# Altium schematic sheet LED_DISPLAY_SCHE.SchDoc
size C; SheetNumber: 3; SheetTotal: 3
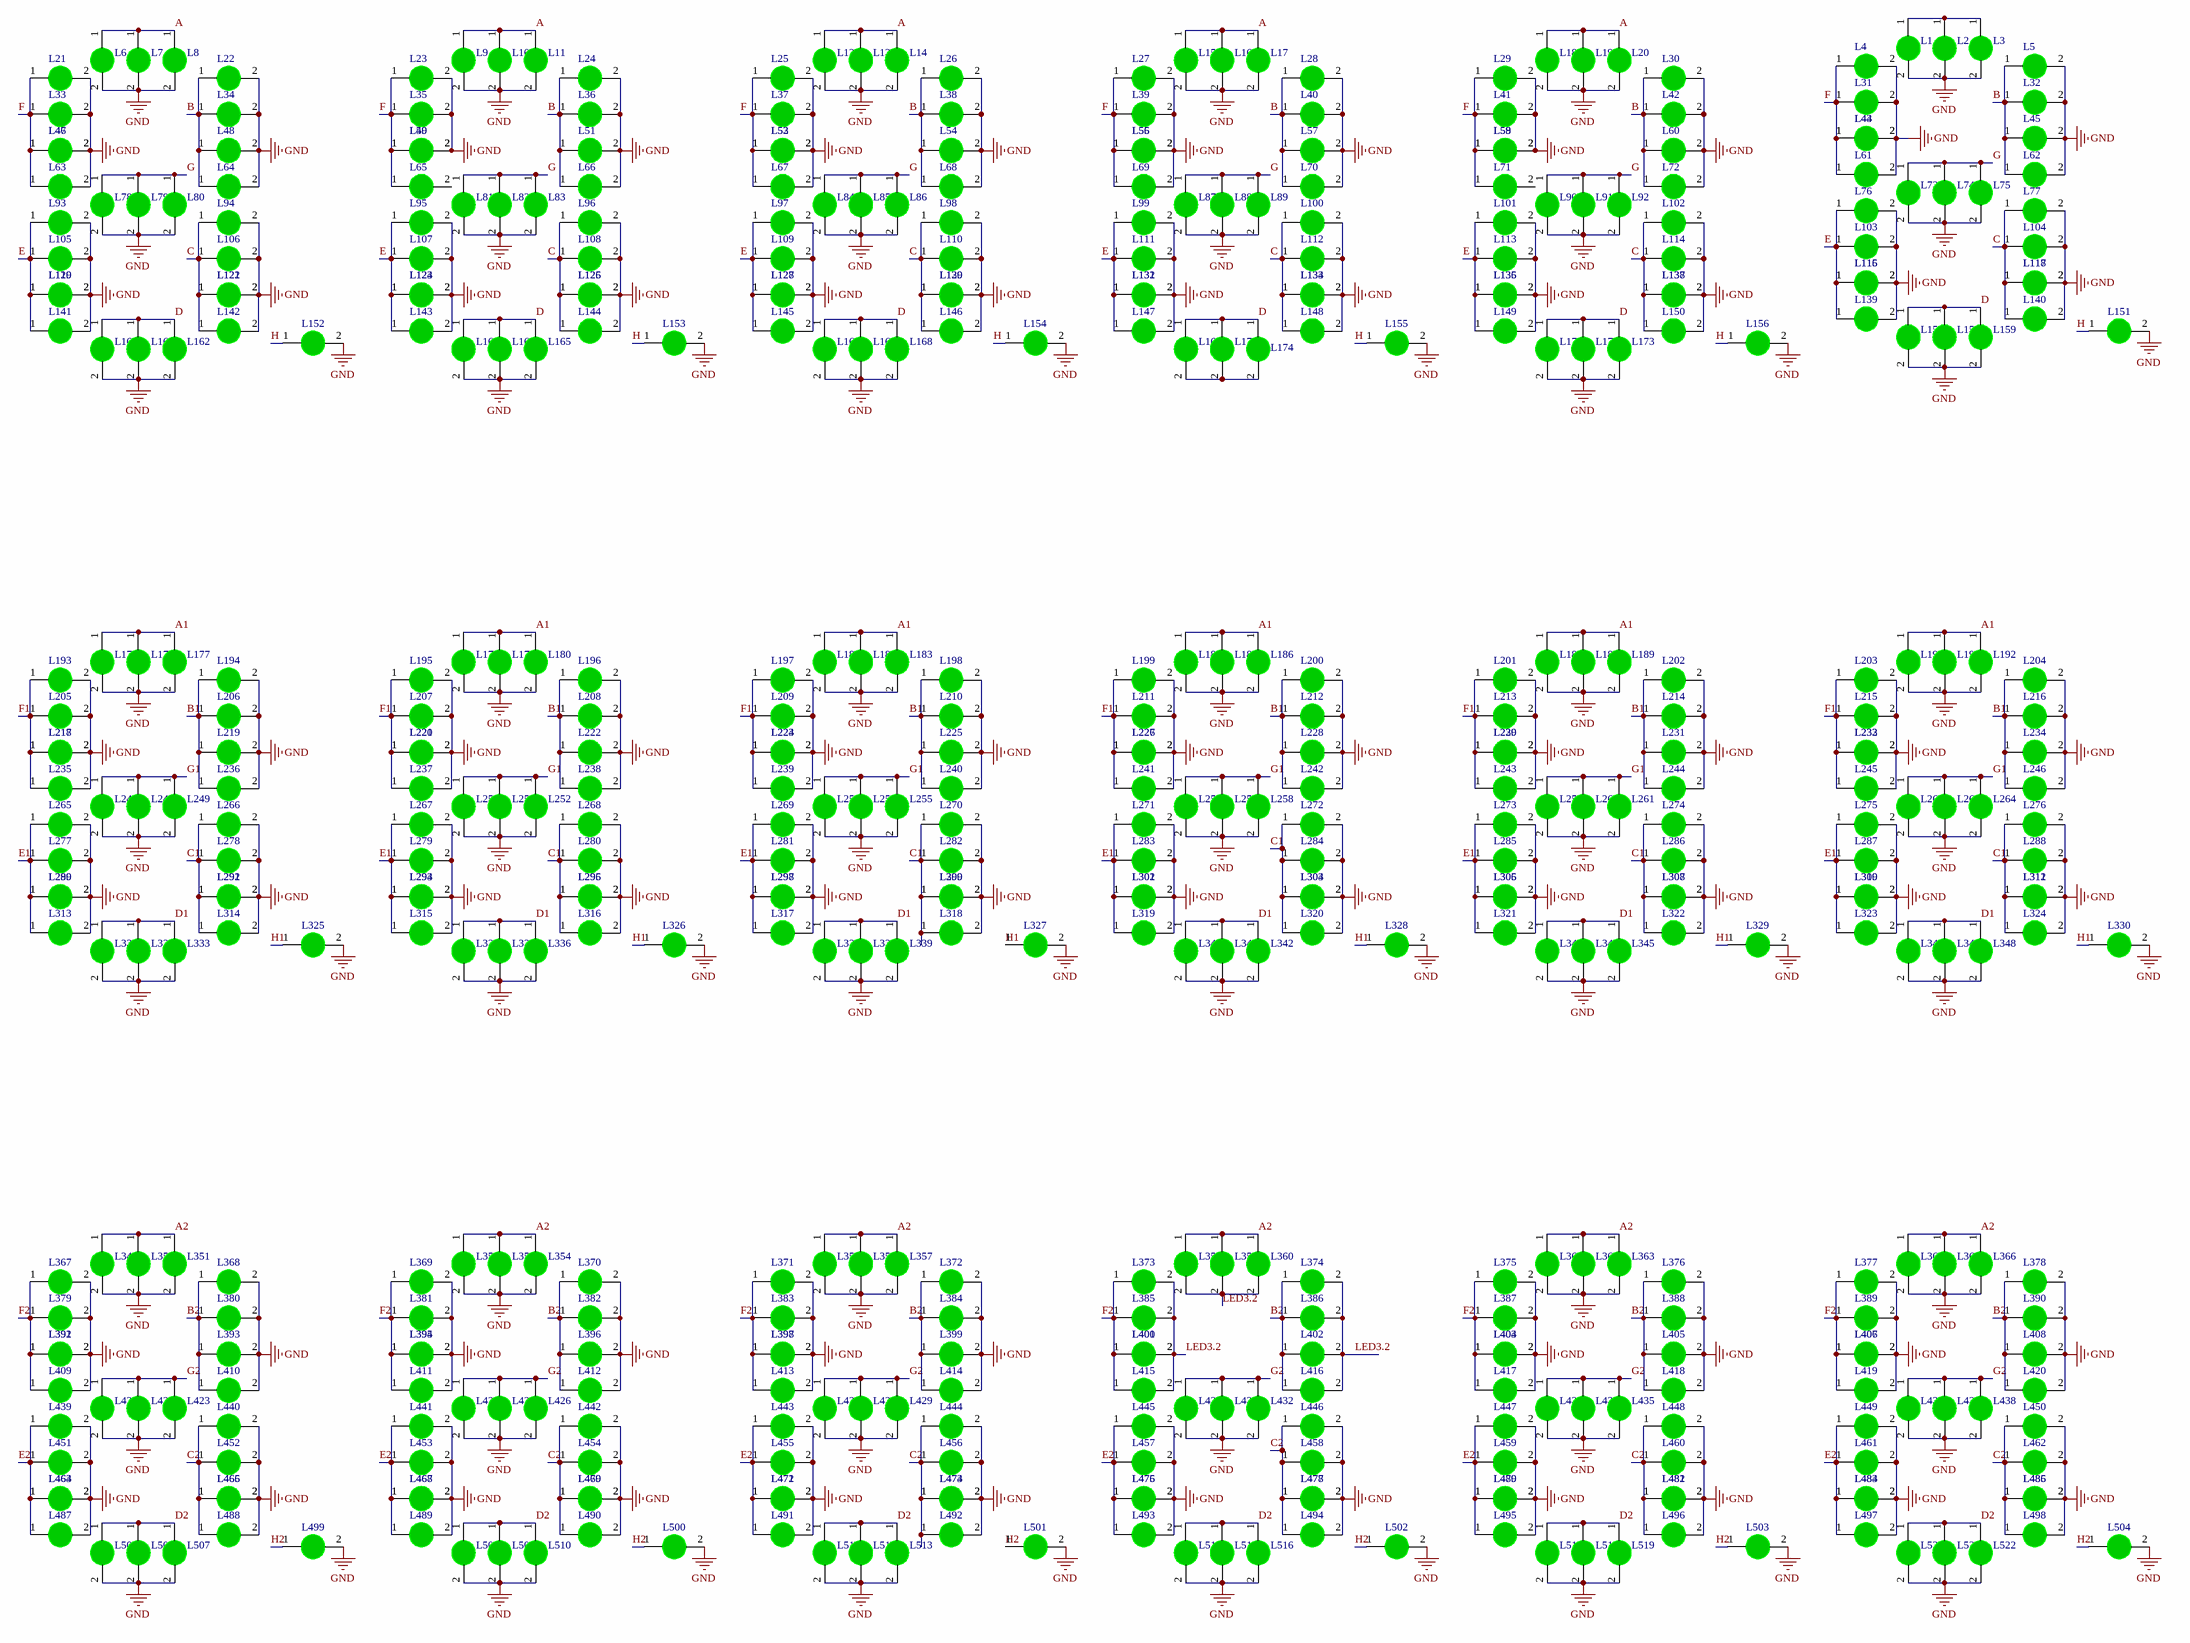
[diagram p0: LED_DISPLAY_SCHE.SchDoc]

## Parts
L1  LED 3528  [LED-3528-GREEN]  (value not drawn)
L2  LED 3528  [LED-3528-GREEN]  (value not drawn)
L3  LED 3528  [LED-3528-GREEN]  (value not drawn)
L4  LED 3528  [LED-3528-GREEN]  (value not drawn)
L5  LED 3528  [LED-3528-GREEN]  (value not drawn)
L6  LED 3528  [LED-3528-GREEN]  (value not drawn)
L7  LED 3528  [LED-3528-GREEN]  (value not drawn)
L8  LED 3528  [LED-3528-GREEN]  (value not drawn)
L9  LED 3528  [LED-3528-GREEN]  (value not drawn)
L10  LED 3528  [LED-3528-GREEN]  (value not drawn)
L11  LED 3528  [LED-3528-GREEN]  (value not drawn)
L12  LED 3528  [LED-3528-GREEN]  (value not drawn)
L13  LED 3528  [LED-3528-GREEN]  (value not drawn)
L14  LED 3528  [LED-3528-GREEN]  (value not drawn)
L15  LED 3528  [LED-3528-GREEN]  (value not drawn)
L16  LED 3528  [LED-3528-GREEN]  (value not drawn)
L17  LED 3528  [LED-3528-GREEN]  (value not drawn)
L18  LED 3528  [LED-3528-GREEN]  (value not drawn)
L19  LED 3528  [LED-3528-GREEN]  (value not drawn)
L20  LED 3528  [LED-3528-GREEN]  (value not drawn)
L21  LED 3528  [LED-3528-GREEN]  (value not drawn)
L22  LED 3528  [LED-3528-GREEN]  (value not drawn)
L23  LED 3528  [LED-3528-GREEN]  (value not drawn)
L24  LED 3528  [LED-3528-GREEN]  (value not drawn)
L25  LED 3528  [LED-3528-GREEN]  (value not drawn)
L26  LED 3528  [LED-3528-GREEN]  (value not drawn)
L27  LED 3528  [LED-3528-GREEN]  (value not drawn)
L28  LED 3528  [LED-3528-GREEN]  (value not drawn)
L29  LED 3528  [LED-3528-GREEN]  (value not drawn)
L30  LED 3528  [LED-3528-GREEN]  (value not drawn)
L31  LED 3528  [LED-3528-GREEN]  (value not drawn)
L32  LED 3528  [LED-3528-GREEN]  (value not drawn)
L33  LED 3528  [LED-3528-GREEN]  (value not drawn)
L34  LED 3528  [LED-3528-GREEN]  (value not drawn)
L35  LED 3528  [LED-3528-GREEN]  (value not drawn)
L36  LED 3528  [LED-3528-GREEN]  (value not drawn)
L37  LED 3528  [LED-3528-GREEN]  (value not drawn)
L38  LED 3528  [LED-3528-GREEN]  (value not drawn)
L39  LED 3528  [LED-3528-GREEN]  (value not drawn)
L40  LED 3528  [LED-3528-GREEN]  (value not drawn)
L41  LED 3528  [LED-3528-GREEN]  (value not drawn)
L42  LED 3528  [LED-3528-GREEN]  (value not drawn)
L43  LED 3528  [LED-3528-GREEN]  (value not drawn)
L44  LED 3528  [LED-3528-GREEN]  (value not drawn)
L45  LED 3528  [LED-3528-GREEN]  (value not drawn)
L46  LED 3528  [LED-3528-GREEN]  (value not drawn)
L47  LED 3528  [LED-3528-GREEN]  (value not drawn)
L48  LED 3528  [LED-3528-GREEN]  (value not drawn)
L49  LED 3528  [LED-3528-GREEN]  (value not drawn)
L50  LED 3528  [LED-3528-GREEN]  (value not drawn)
L51  LED 3528  [LED-3528-GREEN]  (value not drawn)
L52  LED 3528  [LED-3528-GREEN]  (value not drawn)
L53  LED 3528  [LED-3528-GREEN]  (value not drawn)
L54  LED 3528  [LED-3528-GREEN]  (value not drawn)
L55  LED 3528  [LED-3528-GREEN]  (value not drawn)
L56  LED 3528  [LED-3528-GREEN]  (value not drawn)
L57  LED 3528  [LED-3528-GREEN]  (value not drawn)
L58  LED 3528  [LED-3528-GREEN]  (value not drawn)
L59  LED 3528  [LED-3528-GREEN]  (value not drawn)
L60  LED 3528  [LED-3528-GREEN]  (value not drawn)
L61  LED 3528  [LED-3528-GREEN]  (value not drawn)
L62  LED 3528  [LED-3528-GREEN]  (value not drawn)
L63  LED 3528  [LED-3528-GREEN]  (value not drawn)
L64  LED 3528  [LED-3528-GREEN]  (value not drawn)
L65  LED 3528  [LED-3528-GREEN]  (value not drawn)
L66  LED 3528  [LED-3528-GREEN]  (value not drawn)
L67  LED 3528  [LED-3528-GREEN]  (value not drawn)
L68  LED 3528  [LED-3528-GREEN]  (value not drawn)
L69  LED 3528  [LED-3528-GREEN]  (value not drawn)
L70  LED 3528  [LED-3528-GREEN]  (value not drawn)
L71  LED 3528  [LED-3528-GREEN]  (value not drawn)
L72  LED 3528  [LED-3528-GREEN]  (value not drawn)
L73  LED 3528  [LED-3528-GREEN]  (value not drawn)
L74  LED 3528  [LED-3528-GREEN]  (value not drawn)
L75  LED 3528  [LED-3528-GREEN]  (value not drawn)
L76  LED 3528  [LED-3528-GREEN]  (value not drawn)
L77  LED 3528  [LED-3528-GREEN]  (value not drawn)
L78  LED 3528  [LED-3528-GREEN]  (value not drawn)
L79  LED 3528  [LED-3528-GREEN]  (value not drawn)
L80  LED 3528  [LED-3528-GREEN]  (value not drawn)
L81  LED 3528  [LED-3528-GREEN]  (value not drawn)
L82  LED 3528  [LED-3528-GREEN]  (value not drawn)
L83  LED 3528  [LED-3528-GREEN]  (value not drawn)
L84  LED 3528  [LED-3528-GREEN]  (value not drawn)
L85  LED 3528  [LED-3528-GREEN]  (value not drawn)
L86  LED 3528  [LED-3528-GREEN]  (value not drawn)
L87  LED 3528  [LED-3528-GREEN]  (value not drawn)
L88  LED 3528  [LED-3528-GREEN]  (value not drawn)
L89  LED 3528  [LED-3528-GREEN]  (value not drawn)
L90  LED 3528  [LED-3528-GREEN]  (value not drawn)
L91  LED 3528  [LED-3528-GREEN]  (value not drawn)
L92  LED 3528  [LED-3528-GREEN]  (value not drawn)
L93  LED 3528  [LED-3528-GREEN]  (value not drawn)
L94  LED 3528  [LED-3528-GREEN]  (value not drawn)
L95  LED 3528  [LED-3528-GREEN]  (value not drawn)
L96  LED 3528  [LED-3528-GREEN]  (value not drawn)
L97  LED 3528  [LED-3528-GREEN]  (value not drawn)
L98  LED 3528  [LED-3528-GREEN]  (value not drawn)
L99  LED 3528  [LED-3528-GREEN]  (value not drawn)
L100  LED 3528  [LED-3528-GREEN]  (value not drawn)
L101  LED 3528  [LED-3528-GREEN]  (value not drawn)
L102  LED 3528  [LED-3528-GREEN]  (value not drawn)
L103  LED 3528  [LED-3528-GREEN]  (value not drawn)
L104  LED 3528  [LED-3528-GREEN]  (value not drawn)
L105  LED 3528  [LED-3528-GREEN]  (value not drawn)
L106  LED 3528  [LED-3528-GREEN]  (value not drawn)
L107  LED 3528  [LED-3528-GREEN]  (value not drawn)
L108  LED 3528  [LED-3528-GREEN]  (value not drawn)
L109  LED 3528  [LED-3528-GREEN]  (value not drawn)
L110  LED 3528  [LED-3528-GREEN]  (value not drawn)
L111  LED 3528  [LED-3528-GREEN]  (value not drawn)
L112  LED 3528  [LED-3528-GREEN]  (value not drawn)
L113  LED 3528  [LED-3528-GREEN]  (value not drawn)
L114  LED 3528  [LED-3528-GREEN]  (value not drawn)
L115  LED 3528  [LED-3528-GREEN]  (value not drawn)
L116  LED 3528  [LED-3528-GREEN]  (value not drawn)
L117  LED 3528  [LED-3528-GREEN]  (value not drawn)
L118  LED 3528  [LED-3528-GREEN]  (value not drawn)
L119  LED 3528  [LED-3528-GREEN]  (value not drawn)
L120  LED 3528  [LED-3528-GREEN]  (value not drawn)
L121  LED 3528  [LED-3528-GREEN]  (value not drawn)
L122  LED 3528  [LED-3528-GREEN]  (value not drawn)
L123  LED 3528  [LED-3528-GREEN]  (value not drawn)
L124  LED 3528  [LED-3528-GREEN]  (value not drawn)
L125  LED 3528  [LED-3528-GREEN]  (value not drawn)
L126  LED 3528  [LED-3528-GREEN]  (value not drawn)
L127  LED 3528  [LED-3528-GREEN]  (value not drawn)
L128  LED 3528  [LED-3528-GREEN]  (value not drawn)
L129  LED 3528  [LED-3528-GREEN]  (value not drawn)
L130  LED 3528  [LED-3528-GREEN]  (value not drawn)
L131  LED 3528  [LED-3528-GREEN]  (value not drawn)
L132  LED 3528  [LED-3528-GREEN]  (value not drawn)
L133  LED 3528  [LED-3528-GREEN]  (value not drawn)
L134  LED 3528  [LED-3528-GREEN]  (value not drawn)
L135  LED 3528  [LED-3528-GREEN]  (value not drawn)
L136  LED 3528  [LED-3528-GREEN]  (value not drawn)
L137  LED 3528  [LED-3528-GREEN]  (value not drawn)
L138  LED 3528  [LED-3528-GREEN]  (value not drawn)
L139  LED 3528  [LED-3528-GREEN]  (value not drawn)
L140  LED 3528  [LED-3528-GREEN]  (value not drawn)
L141  LED 3528  [LED-3528-GREEN]  (value not drawn)
L142  LED 3528  [LED-3528-GREEN]  (value not drawn)
L143  LED 3528  [LED-3528-GREEN]  (value not drawn)
L144  LED 3528  [LED-3528-GREEN]  (value not drawn)
L145  LED 3528  [LED-3528-GREEN]  (value not drawn)
L146  LED 3528  [LED-3528-GREEN]  (value not drawn)
L147  LED 3528  [LED-3528-GREEN]  (value not drawn)
L148  LED 3528  [LED-3528-GREEN]  (value not drawn)
L149  LED 3528  [LED-3528-GREEN]  (value not drawn)
L150  LED 3528  [LED-3528-GREEN]  (value not drawn)
L151  LED 3528  [LED-3528-GREEN]  (value not drawn)
L152  LED 3528  [LED-3528-GREEN]  (value not drawn)
L153  LED 3528  [LED-3528-GREEN]  (value not drawn)
L154  LED 3528  [LED-3528-GREEN]  (value not drawn)
L155  LED 3528  [LED-3528-GREEN]  (value not drawn)
L156  LED 3528  [LED-3528-GREEN]  (value not drawn)
L157  LED 3528  [LED-3528-GREEN]  (value not drawn)
L158  LED 3528  [LED-3528-GREEN]  (value not drawn)
L159  LED 3528  [LED-3528-GREEN]  (value not drawn)
L160  LED 3528  [LED-3528-GREEN]  (value not drawn)
L161  LED 3528  [LED-3528-GREEN]  (value not drawn)
L162  LED 3528  [LED-3528-GREEN]  (value not drawn)
L163  LED 3528  [LED-3528-GREEN]  (value not drawn)
L164  LED 3528  [LED-3528-GREEN]  (value not drawn)
L165  LED 3528  [LED-3528-GREEN]  (value not drawn)
L166  LED 3528  [LED-3528-GREEN]  (value not drawn)
L167  LED 3528  [LED-3528-GREEN]  (value not drawn)
L168  LED 3528  [LED-3528-GREEN]  (value not drawn)
L169  LED 3528  [LED-3528-GREEN]  (value not drawn)
L170  LED 3528  [LED-3528-GREEN]  (value not drawn)
L171  LED 3528  [LED-3528-GREEN]  (value not drawn)
L172  LED 3528  [LED-3528-GREEN]  (value not drawn)
L173  LED 3528  [LED-3528-GREEN]  (value not drawn)
L174  LED 3528  [LED-3528-GREEN]  (value not drawn)
L175  LED 3528  [LED-3528-GREEN]  (value not drawn)
L176  LED 3528  [LED-3528-GREEN]  (value not drawn)
L177  LED 3528  [LED-3528-GREEN]  (value not drawn)
L178  LED 3528  [LED-3528-GREEN]  (value not drawn)
L179  LED 3528  [LED-3528-GREEN]  (value not drawn)
L180  LED 3528  [LED-3528-GREEN]  (value not drawn)
L181  LED 3528  [LED-3528-GREEN]  (value not drawn)
L182  LED 3528  [LED-3528-GREEN]  (value not drawn)
L183  LED 3528  [LED-3528-GREEN]  (value not drawn)
L184  LED 3528  [LED-3528-GREEN]  (value not drawn)
L185  LED 3528  [LED-3528-GREEN]  (value not drawn)
L186  LED 3528  [LED-3528-GREEN]  (value not drawn)
L187  LED 3528  [LED-3528-GREEN]  (value not drawn)
L188  LED 3528  [LED-3528-GREEN]  (value not drawn)
L189  LED 3528  [LED-3528-GREEN]  (value not drawn)
L190  LED 3528  [LED-3528-GREEN]  (value not drawn)
L191  LED 3528  [LED-3528-GREEN]  (value not drawn)
L192  LED 3528  [LED-3528-GREEN]  (value not drawn)
L193  LED 3528  [LED-3528-GREEN]  (value not drawn)
L194  LED 3528  [LED-3528-GREEN]  (value not drawn)
L195  LED 3528  [LED-3528-GREEN]  (value not drawn)
L196  LED 3528  [LED-3528-GREEN]  (value not drawn)
L197  LED 3528  [LED-3528-GREEN]  (value not drawn)
L198  LED 3528  [LED-3528-GREEN]  (value not drawn)
L199  LED 3528  [LED-3528-GREEN]  (value not drawn)
L200  LED 3528  [LED-3528-GREEN]  (value not drawn)
L201  LED 3528  [LED-3528-GREEN]  (value not drawn)
L202  LED 3528  [LED-3528-GREEN]  (value not drawn)
L203  LED 3528  [LED-3528-GREEN]  (value not drawn)
L204  LED 3528  [LED-3528-GREEN]  (value not drawn)
L205  LED 3528  [LED-3528-GREEN]  (value not drawn)
L206  LED 3528  [LED-3528-GREEN]  (value not drawn)
L207  LED 3528  [LED-3528-GREEN]  (value not drawn)
L208  LED 3528  [LED-3528-GREEN]  (value not drawn)
L209  LED 3528  [LED-3528-GREEN]  (value not drawn)
L210  LED 3528  [LED-3528-GREEN]  (value not drawn)
L211  LED 3528  [LED-3528-GREEN]  (value not drawn)
L212  LED 3528  [LED-3528-GREEN]  (value not drawn)
L213  LED 3528  [LED-3528-GREEN]  (value not drawn)
L214  LED 3528  [LED-3528-GREEN]  (value not drawn)
L215  LED 3528  [LED-3528-GREEN]  (value not drawn)
L216  LED 3528  [LED-3528-GREEN]  (value not drawn)
L217  LED 3528  [LED-3528-GREEN]  (value not drawn)
L218  LED 3528  [LED-3528-GREEN]  (value not drawn)
L219  LED 3528  [LED-3528-GREEN]  (value not drawn)
L220  LED 3528  [LED-3528-GREEN]  (value not drawn)
L221  LED 3528  [LED-3528-GREEN]  (value not drawn)
L222  LED 3528  [LED-3528-GREEN]  (value not drawn)
L223  LED 3528  [LED-3528-GREEN]  (value not drawn)
L224  LED 3528  [LED-3528-GREEN]  (value not drawn)
L225  LED 3528  [LED-3528-GREEN]  (value not drawn)
L226  LED 3528  [LED-3528-GREEN]  (value not drawn)
L227  LED 3528  [LED-3528-GREEN]  (value not drawn)
L228  LED 3528  [LED-3528-GREEN]  (value not drawn)
L229  LED 3528  [LED-3528-GREEN]  (value not drawn)
L230  LED 3528  [LED-3528-GREEN]  (value not drawn)
L231  LED 3528  [LED-3528-GREEN]  (value not drawn)
L232  LED 3528  [LED-3528-GREEN]  (value not drawn)
L233  LED 3528  [LED-3528-GREEN]  (value not drawn)
L234  LED 3528  [LED-3528-GREEN]  (value not drawn)
L235  LED 3528  [LED-3528-GREEN]  (value not drawn)
L236  LED 3528  [LED-3528-GREEN]  (value not drawn)
L237  LED 3528  [LED-3528-GREEN]  (value not drawn)
L238  LED 3528  [LED-3528-GREEN]  (value not drawn)
L239  LED 3528  [LED-3528-GREEN]  (value not drawn)
L240  LED 3528  [LED-3528-GREEN]  (value not drawn)
L241  LED 3528  [LED-3528-GREEN]  (value not drawn)
L242  LED 3528  [LED-3528-GREEN]  (value not drawn)
L243  LED 3528  [LED-3528-GREEN]  (value not drawn)
L244  LED 3528  [LED-3528-GREEN]  (value not drawn)
L245  LED 3528  [LED-3528-GREEN]  (value not drawn)
L246  LED 3528  [LED-3528-GREEN]  (value not drawn)
L247  LED 3528  [LED-3528-GREEN]  (value not drawn)
L248  LED 3528  [LED-3528-GREEN]  (value not drawn)
L249  LED 3528  [LED-3528-GREEN]  (value not drawn)
L250  LED 3528  [LED-3528-GREEN]  (value not drawn)
L251  LED 3528  [LED-3528-GREEN]  (value not drawn)
L252  LED 3528  [LED-3528-GREEN]  (value not drawn)
L253  LED 3528  [LED-3528-GREEN]  (value not drawn)
L254  LED 3528  [LED-3528-GREEN]  (value not drawn)
L255  LED 3528  [LED-3528-GREEN]  (value not drawn)
L256  LED 3528  [LED-3528-GREEN]  (value not drawn)
L257  LED 3528  [LED-3528-GREEN]  (value not drawn)
L258  LED 3528  [LED-3528-GREEN]  (value not drawn)
L259  LED 3528  [LED-3528-GREEN]  (value not drawn)
L260  LED 3528  [LED-3528-GREEN]  (value not drawn)
L261  LED 3528  [LED-3528-GREEN]  (value not drawn)
L262  LED 3528  [LED-3528-GREEN]  (value not drawn)
L263  LED 3528  [LED-3528-GREEN]  (value not drawn)
L264  LED 3528  [LED-3528-GREEN]  (value not drawn)
L265  LED 3528  [LED-3528-GREEN]  (value not drawn)
L266  LED 3528  [LED-3528-GREEN]  (value not drawn)
L267  LED 3528  [LED-3528-GREEN]  (value not drawn)
L268  LED 3528  [LED-3528-GREEN]  (value not drawn)
L269  LED 3528  [LED-3528-GREEN]  (value not drawn)
L270  LED 3528  [LED-3528-GREEN]  (value not drawn)
L271  LED 3528  [LED-3528-GREEN]  (value not drawn)
L272  LED 3528  [LED-3528-GREEN]  (value not drawn)
L273  LED 3528  [LED-3528-GREEN]  (value not drawn)
L274  LED 3528  [LED-3528-GREEN]  (value not drawn)
L275  LED 3528  [LED-3528-GREEN]  (value not drawn)
L276  LED 3528  [LED-3528-GREEN]  (value not drawn)
L277  LED 3528  [LED-3528-GREEN]  (value not drawn)
L278  LED 3528  [LED-3528-GREEN]  (value not drawn)
L279  LED 3528  [LED-3528-GREEN]  (value not drawn)
L280  LED 3528  [LED-3528-GREEN]  (value not drawn)
L281  LED 3528  [LED-3528-GREEN]  (value not drawn)
L282  LED 3528  [LED-3528-GREEN]  (value not drawn)
L283  LED 3528  [LED-3528-GREEN]  (value not drawn)
L284  LED 3528  [LED-3528-GREEN]  (value not drawn)
L285  LED 3528  [LED-3528-GREEN]  (value not drawn)
L286  LED 3528  [LED-3528-GREEN]  (value not drawn)
L287  LED 3528  [LED-3528-GREEN]  (value not drawn)
L288  LED 3528  [LED-3528-GREEN]  (value not drawn)
L289  LED 3528  [LED-3528-GREEN]  (value not drawn)
L290  LED 3528  [LED-3528-GREEN]  (value not drawn)
L291  LED 3528  [LED-3528-GREEN]  (value not drawn)
L292  LED 3528  [LED-3528-GREEN]  (value not drawn)
L293  LED 3528  [LED-3528-GREEN]  (value not drawn)
L294  LED 3528  [LED-3528-GREEN]  (value not drawn)
L295  LED 3528  [LED-3528-GREEN]  (value not drawn)
L296  LED 3528  [LED-3528-GREEN]  (value not drawn)
L297  LED 3528  [LED-3528-GREEN]  (value not drawn)
L298  LED 3528  [LED-3528-GREEN]  (value not drawn)
L299  LED 3528  [LED-3528-GREEN]  (value not drawn)
L300  LED 3528  [LED-3528-GREEN]  (value not drawn)
L301  LED 3528  [LED-3528-GREEN]  (value not drawn)
L302  LED 3528  [LED-3528-GREEN]  (value not drawn)
L303  LED 3528  [LED-3528-GREEN]  (value not drawn)
L304  LED 3528  [LED-3528-GREEN]  (value not drawn)
L305  LED 3528  [LED-3528-GREEN]  (value not drawn)
L306  LED 3528  [LED-3528-GREEN]  (value not drawn)
L307  LED 3528  [LED-3528-GREEN]  (value not drawn)
L308  LED 3528  [LED-3528-GREEN]  (value not drawn)
L309  LED 3528  [LED-3528-GREEN]  (value not drawn)
L310  LED 3528  [LED-3528-GREEN]  (value not drawn)
L311  LED 3528  [LED-3528-GREEN]  (value not drawn)
L312  LED 3528  [LED-3528-GREEN]  (value not drawn)
L313  LED 3528  [LED-3528-GREEN]  (value not drawn)
L314  LED 3528  [LED-3528-GREEN]  (value not drawn)
L315  LED 3528  [LED-3528-GREEN]  (value not drawn)
L316  LED 3528  [LED-3528-GREEN]  (value not drawn)
L317  LED 3528  [LED-3528-GREEN]  (value not drawn)
L318  LED 3528  [LED-3528-GREEN]  (value not drawn)
L319  LED 3528  [LED-3528-GREEN]  (value not drawn)
L320  LED 3528  [LED-3528-GREEN]  (value not drawn)
L321  LED 3528  [LED-3528-GREEN]  (value not drawn)
L322  LED 3528  [LED-3528-GREEN]  (value not drawn)
L323  LED 3528  [LED-3528-GREEN]  (value not drawn)
L324  LED 3528  [LED-3528-GREEN]  (value not drawn)
L325  LED 3528  [LED-3528-GREEN]  (value not drawn)
L326  LED 3528  [LED-3528-GREEN]  (value not drawn)
L327  LED 3528  [LED-3528-GREEN]  (value not drawn)
L328  LED 3528  [LED-3528-GREEN]  (value not drawn)
L329  LED 3528  [LED-3528-GREEN]  (value not drawn)
L330  LED 3528  [LED-3528-GREEN]  (value not drawn)
L331  LED 3528  [LED-3528-GREEN]  (value not drawn)
L332  LED 3528  [LED-3528-GREEN]  (value not drawn)
L333  LED 3528  [LED-3528-GREEN]  (value not drawn)
L334  LED 3528  [LED-3528-GREEN]  (value not drawn)
L335  LED 3528  [LED-3528-GREEN]  (value not drawn)
L336  LED 3528  [LED-3528-GREEN]  (value not drawn)
L337  LED 3528  [LED-3528-GREEN]  (value not drawn)
L338  LED 3528  [LED-3528-GREEN]  (value not drawn)
L339  LED 3528  [LED-3528-GREEN]  (value not drawn)
L340  LED 3528  [LED-3528-GREEN]  (value not drawn)
L341  LED 3528  [LED-3528-GREEN]  (value not drawn)
L342  LED 3528  [LED-3528-GREEN]  (value not drawn)
L343  LED 3528  [LED-3528-GREEN]  (value not drawn)
L344  LED 3528  [LED-3528-GREEN]  (value not drawn)
L345  LED 3528  [LED-3528-GREEN]  (value not drawn)
L346  LED 3528  [LED-3528-GREEN]  (value not drawn)
L347  LED 3528  [LED-3528-GREEN]  (value not drawn)
L348  LED 3528  [LED-3528-GREEN]  (value not drawn)
L349  LED 3528  [LED-3528-GREEN]  (value not drawn)
L350  LED 3528  [LED-3528-GREEN]  (value not drawn)
L351  LED 3528  [LED-3528-GREEN]  (value not drawn)
L352  LED 3528  [LED-3528-GREEN]  (value not drawn)
L353  LED 3528  [LED-3528-GREEN]  (value not drawn)
L354  LED 3528  [LED-3528-GREEN]  (value not drawn)
L355  LED 3528  [LED-3528-GREEN]  (value not drawn)
L356  LED 3528  [LED-3528-GREEN]  (value not drawn)
L357  LED 3528  [LED-3528-GREEN]  (value not drawn)
L358  LED 3528  [LED-3528-GREEN]  (value not drawn)
L359  LED 3528  [LED-3528-GREEN]  (value not drawn)
L360  LED 3528  [LED-3528-GREEN]  (value not drawn)
L361  LED 3528  [LED-3528-GREEN]  (value not drawn)
L362  LED 3528  [LED-3528-GREEN]  (value not drawn)
L363  LED 3528  [LED-3528-GREEN]  (value not drawn)
L364  LED 3528  [LED-3528-GREEN]  (value not drawn)
L365  LED 3528  [LED-3528-GREEN]  (value not drawn)
L366  LED 3528  [LED-3528-GREEN]  (value not drawn)
L367  LED 3528  [LED-3528-GREEN]  (value not drawn)
L368  LED 3528  [LED-3528-GREEN]  (value not drawn)
L369  LED 3528  [LED-3528-GREEN]  (value not drawn)
L370  LED 3528  [LED-3528-GREEN]  (value not drawn)
L371  LED 3528  [LED-3528-GREEN]  (value not drawn)
L372  LED 3528  [LED-3528-GREEN]  (value not drawn)
L373  LED 3528  [LED-3528-GREEN]  (value not drawn)
L374  LED 3528  [LED-3528-GREEN]  (value not drawn)
L375  LED 3528  [LED-3528-GREEN]  (value not drawn)
L376  LED 3528  [LED-3528-GREEN]  (value not drawn)
L377  LED 3528  [LED-3528-GREEN]  (value not drawn)
L378  LED 3528  [LED-3528-GREEN]  (value not drawn)
L379  LED 3528  [LED-3528-GREEN]  (value not drawn)
L380  LED 3528  [LED-3528-GREEN]  (value not drawn)
L381  LED 3528  [LED-3528-GREEN]  (value not drawn)
L382  LED 3528  [LED-3528-GREEN]  (value not drawn)
L383  LED 3528  [LED-3528-GREEN]  (value not drawn)
L384  LED 3528  [LED-3528-GREEN]  (value not drawn)
L385  LED 3528  [LED-3528-GREEN]  (value not drawn)
L386  LED 3528  [LED-3528-GREEN]  (value not drawn)
L387  LED 3528  [LED-3528-GREEN]  (value not drawn)
L388  LED 3528  [LED-3528-GREEN]  (value not drawn)
L389  LED 3528  [LED-3528-GREEN]  (value not drawn)
L390  LED 3528  [LED-3528-GREEN]  (value not drawn)
L391  LED 3528  [LED-3528-GREEN]  (value not drawn)
L392  LED 3528  [LED-3528-GREEN]  (value not drawn)
L393  LED 3528  [LED-3528-GREEN]  (value not drawn)
L394  LED 3528  [LED-3528-GREEN]  (value not drawn)
L395  LED 3528  [LED-3528-GREEN]  (value not drawn)
L396  LED 3528  [LED-3528-GREEN]  (value not drawn)
L397  LED 3528  [LED-3528-GREEN]  (value not drawn)
L398  LED 3528  [LED-3528-GREEN]  (value not drawn)
L399  LED 3528  [LED-3528-GREEN]  (value not drawn)
L400  LED 3528  [LED-3528-GREEN]  (value not drawn)
L401  LED 3528  [LED-3528-GREEN]  (value not drawn)
L402  LED 3528  [LED-3528-GREEN]  (value not drawn)
L403  LED 3528  [LED-3528-GREEN]  (value not drawn)
L404  LED 3528  [LED-3528-GREEN]  (value not drawn)
L405  LED 3528  [LED-3528-GREEN]  (value not drawn)
L406  LED 3528  [LED-3528-GREEN]  (value not drawn)
L407  LED 3528  [LED-3528-GREEN]  (value not drawn)
L408  LED 3528  [LED-3528-GREEN]  (value not drawn)
L409  LED 3528  [LED-3528-GREEN]  (value not drawn)
L410  LED 3528  [LED-3528-GREEN]  (value not drawn)
L411  LED 3528  [LED-3528-GREEN]  (value not drawn)
L412  LED 3528  [LED-3528-GREEN]  (value not drawn)
L413  LED 3528  [LED-3528-GREEN]  (value not drawn)
L414  LED 3528  [LED-3528-GREEN]  (value not drawn)
L415  LED 3528  [LED-3528-GREEN]  (value not drawn)
L416  LED 3528  [LED-3528-GREEN]  (value not drawn)
L417  LED 3528  [LED-3528-GREEN]  (value not drawn)
L418  LED 3528  [LED-3528-GREEN]  (value not drawn)
L419  LED 3528  [LED-3528-GREEN]  (value not drawn)
L420  LED 3528  [LED-3528-GREEN]  (value not drawn)
L421  LED 3528  [LED-3528-GREEN]  (value not drawn)
L422  LED 3528  [LED-3528-GREEN]  (value not drawn)
L423  LED 3528  [LED-3528-GREEN]  (value not drawn)
L424  LED 3528  [LED-3528-GREEN]  (value not drawn)
L425  LED 3528  [LED-3528-GREEN]  (value not drawn)
L426  LED 3528  [LED-3528-GREEN]  (value not drawn)
L427  LED 3528  [LED-3528-GREEN]  (value not drawn)
L428  LED 3528  [LED-3528-GREEN]  (value not drawn)
L429  LED 3528  [LED-3528-GREEN]  (value not drawn)
L430  LED 3528  [LED-3528-GREEN]  (value not drawn)
L431  LED 3528  [LED-3528-GREEN]  (value not drawn)
L432  LED 3528  [LED-3528-GREEN]  (value not drawn)
L433  LED 3528  [LED-3528-GREEN]  (value not drawn)
L434  LED 3528  [LED-3528-GREEN]  (value not drawn)
L435  LED 3528  [LED-3528-GREEN]  (value not drawn)
L436  LED 3528  [LED-3528-GREEN]  (value not drawn)
L437  LED 3528  [LED-3528-GREEN]  (value not drawn)
L438  LED 3528  [LED-3528-GREEN]  (value not drawn)
L439  LED 3528  [LED-3528-GREEN]  (value not drawn)
L440  LED 3528  [LED-3528-GREEN]  (value not drawn)
L441  LED 3528  [LED-3528-GREEN]  (value not drawn)
L442  LED 3528  [LED-3528-GREEN]  (value not drawn)
L443  LED 3528  [LED-3528-GREEN]  (value not drawn)
L444  LED 3528  [LED-3528-GREEN]  (value not drawn)
L445  LED 3528  [LED-3528-GREEN]  (value not drawn)
L446  LED 3528  [LED-3528-GREEN]  (value not drawn)
L447  LED 3528  [LED-3528-GREEN]  (value not drawn)
L448  LED 3528  [LED-3528-GREEN]  (value not drawn)
L449  LED 3528  [LED-3528-GREEN]  (value not drawn)
L450  LED 3528  [LED-3528-GREEN]  (value not drawn)
L451  LED 3528  [LED-3528-GREEN]  (value not drawn)
L452  LED 3528  [LED-3528-GREEN]  (value not drawn)
L453  LED 3528  [LED-3528-GREEN]  (value not drawn)
L454  LED 3528  [LED-3528-GREEN]  (value not drawn)
L455  LED 3528  [LED-3528-GREEN]  (value not drawn)
L456  LED 3528  [LED-3528-GREEN]  (value not drawn)
L457  LED 3528  [LED-3528-GREEN]  (value not drawn)
L458  LED 3528  [LED-3528-GREEN]  (value not drawn)
L459  LED 3528  [LED-3528-GREEN]  (value not drawn)
L460  LED 3528  [LED-3528-GREEN]  (value not drawn)
L461  LED 3528  [LED-3528-GREEN]  (value not drawn)
L462  LED 3528  [LED-3528-GREEN]  (value not drawn)
L463  LED 3528  [LED-3528-GREEN]  (value not drawn)
L464  LED 3528  [LED-3528-GREEN]  (value not drawn)
L465  LED 3528  [LED-3528-GREEN]  (value not drawn)
L466  LED 3528  [LED-3528-GREEN]  (value not drawn)
L467  LED 3528  [LED-3528-GREEN]  (value not drawn)
L468  LED 3528  [LED-3528-GREEN]  (value not drawn)
L469  LED 3528  [LED-3528-GREEN]  (value not drawn)
L470  LED 3528  [LED-3528-GREEN]  (value not drawn)
L471  LED 3528  [LED-3528-GREEN]  (value not drawn)
L472  LED 3528  [LED-3528-GREEN]  (value not drawn)
L473  LED 3528  [LED-3528-GREEN]  (value not drawn)
L474  LED 3528  [LED-3528-GREEN]  (value not drawn)
L475  LED 3528  [LED-3528-GREEN]  (value not drawn)
L476  LED 3528  [LED-3528-GREEN]  (value not drawn)
L477  LED 3528  [LED-3528-GREEN]  (value not drawn)
L478  LED 3528  [LED-3528-GREEN]  (value not drawn)
L479  LED 3528  [LED-3528-GREEN]  (value not drawn)
L480  LED 3528  [LED-3528-GREEN]  (value not drawn)
L481  LED 3528  [LED-3528-GREEN]  (value not drawn)
L482  LED 3528  [LED-3528-GREEN]  (value not drawn)
L483  LED 3528  [LED-3528-GREEN]  (value not drawn)
L484  LED 3528  [LED-3528-GREEN]  (value not drawn)
L485  LED 3528  [LED-3528-GREEN]  (value not drawn)
L486  LED 3528  [LED-3528-GREEN]  (value not drawn)
L487  LED 3528  [LED-3528-GREEN]  (value not drawn)
L488  LED 3528  [LED-3528-GREEN]  (value not drawn)
L489  LED 3528  [LED-3528-GREEN]  (value not drawn)
L490  LED 3528  [LED-3528-GREEN]  (value not drawn)
L491  LED 3528  [LED-3528-GREEN]  (value not drawn)
L492  LED 3528  [LED-3528-GREEN]  (value not drawn)
L493  LED 3528  [LED-3528-GREEN]  (value not drawn)
L494  LED 3528  [LED-3528-GREEN]  (value not drawn)
L495  LED 3528  [LED-3528-GREEN]  (value not drawn)
L496  LED 3528  [LED-3528-GREEN]  (value not drawn)
L497  LED 3528  [LED-3528-GREEN]  (value not drawn)
L498  LED 3528  [LED-3528-GREEN]  (value not drawn)
L499  LED 3528  [LED-3528-GREEN]  (value not drawn)
L500  LED 3528  [LED-3528-GREEN]  (value not drawn)
L501  LED 3528  [LED-3528-GREEN]  (value not drawn)
L502  LED 3528  [LED-3528-GREEN]  (value not drawn)
L503  LED 3528  [LED-3528-GREEN]  (value not drawn)
L504  LED 3528  [LED-3528-GREEN]  (value not drawn)
L505  LED 3528  [LED-3528-GREEN]  (value not drawn)
L506  LED 3528  [LED-3528-GREEN]  (value not drawn)
L507  LED 3528  [LED-3528-GREEN]  (value not drawn)
L508  LED 3528  [LED-3528-GREEN]  (value not drawn)
L509  LED 3528  [LED-3528-GREEN]  (value not drawn)
L510  LED 3528  [LED-3528-GREEN]  (value not drawn)
L511  LED 3528  [LED-3528-GREEN]  (value not drawn)
L512  LED 3528  [LED-3528-GREEN]  (value not drawn)
L513  LED 3528  [LED-3528-GREEN]  (value not drawn)
L514  LED 3528  [LED-3528-GREEN]  (value not drawn)
L515  LED 3528  [LED-3528-GREEN]  (value not drawn)
L516  LED 3528  [LED-3528-GREEN]  (value not drawn)
L517  LED 3528  [LED-3528-GREEN]  (value not drawn)
L518  LED 3528  [LED-3528-GREEN]  (value not drawn)
L519  LED 3528  [LED-3528-GREEN]  (value not drawn)
L520  LED 3528  [LED-3528-GREEN]  (value not drawn)
L521  LED 3528  [LED-3528-GREEN]  (value not drawn)
L522  LED 3528  [LED-3528-GREEN]  (value not drawn)

## Nets
GND: L1.2(K) L2.2(K) L3.2(K) L4.2(K) L5.2(K) L6.2(K) L7.2(K) L8.2(K) L9.2(K) L10.2(K) L11.2(K) L12.2(K) L13.2(K) L14.2(K) L15.2(K) L16.2(K) L17.2(K) L18.2(K) L19.2(K) L20.2(K) L21.2(K) L22.2(K) L23.2(K) L24.2(K) L25.2(K) L26.2(K) L27.2(K) L28.2(K) L29.2(K) L30.2(K) L31.2(K) L32.2(K) L33.2(K) L34.2(K) L35.2(K) L36.2(K) L37.2(K) L38.2(K) L39.2(K) L40.2(K) L41.2(K) L42.2(K) L43.2(K) L44.2(K) L45.2(K) L46.2(K) L47.2(K) L48.2(K) L49.2(K) L50.2(K) L51.2(K) L52.2(K) L53.2(K) L54.2(K) L55.2(K) L56.2(K) L57.2(K) L58.2(K) L59.2(K) L60.2(K) L61.2(K) L62.2(K) L63.2(K) L64.2(K) L66.2(K) L67.2(K) L68.2(K) L69.2(K) L70.2(K) L72.2(K) L73.2(K) L74.2(K) L75.2(K) L76.2(K) L77.2(K) L78.2(K) L79.2(K) L80.2(K) L81.2(K) L82.2(K) L83.2(K) L84.2(K) L85.2(K) L86.2(K) L87.2(K) L88.2(K) L89.2(K) L90.2(K) L91.2(K) L92.2(K) L93.2(K) L94.2(K) L95.2(K) L96.2(K) L97.2(K) L98.2(K) L99.2(K) L100.2(K) L101.2(K) L102.2(K) L103.2(K) L104.2(K) L105.2(K) L106.2(K) L107.2(K) L108.2(K) L109.2(K) L110.2(K) L111.2(K) L112.2(K) L113.2(K) L114.2(K) L115.2(K) L116.2(K) L117.2(K) L118.2(K) L119.2(K) L120.2(K) L121.2(K) L122.2(K) L123.2(K) L124.2(K) L125.2(K) L126.2(K) L127.2(K) L128.2(K) L129.2(K) L130.2(K) L131.2(K) L132.2(K) L133.2(K) L134.2(K) L135.2(K) L136.2(K) L137.2(K) L138.2(K) L139.2(K) L140.2(K) L141.2(K) L142.2(K) L143.2(K) L144.2(K) L145.2(K) L146.2(K) L147.2(K) L148.2(K) L149.2(K) L150.2(K) L151.2(K) L152.2(K) L153.2(K) L154.2(K) L155.2(K) L156.2(K) L157.2(K) L158.2(K) L159.2(K) L160.2(K) L161.2(K) L162.2(K) L163.2(K) L164.2(K) L165.2(K) L166.2(K) L167.2(K) L168.2(K) L171.2(K) L172.2(K) L173.2(K) L175.2(K) L176.2(K) L177.2(K) L178.2(K) L179.2(K) L180.2(K) L181.2(K) L182.2(K) L183.2(K) L184.2(K) L185.2(K) L186.2(K) L187.2(K) L188.2(K) L189.2(K) L190.2(K) L191.2(K) L192.2(K) L193.2(K) L194.2(K) L195.2(K) L196.2(K) L197.2(K) L198.2(K) L199.2(K) L200.2(K) L201.2(K) L202.2(K) L203.2(K) L204.2(K) L205.2(K) L206.2(K) L207.2(K) L208.2(K) L209.2(K) L210.2(K) L211.2(K) L212.2(K) L213.2(K) L214.2(K) L215.2(K) L216.2(K) L217.2(K) L218.2(K) L219.2(K) L220.2(K) L221.2(K) L222.2(K) L223.2(K) L224.2(K) L225.2(K) L226.2(K) L227.2(K) L228.2(K) L229.2(K) L230.2(K) L231.2(K) L232.2(K) L233.2(K) L234.2(K) L235.2(K) L236.2(K) L237.2(K) L238.2(K) L239.2(K) L240.2(K) L241.2(K) L242.2(K) L243.2(K) L244.2(K) L245.2(K) L246.2(K) L247.2(K) L248.2(K) L249.2(K) L250.2(K) L251.2(K) L252.2(K) L253.2(K) L254.2(K) L255.2(K) L256.2(K) L257.2(K) L258.2(K) L259.2(K) L260.2(K) L261.2(K) L262.2(K) L263.2(K) L264.2(K) L265.2(K) L266.2(K) L267.2(K) L268.2(K) L269.2(K) L270.2(K) L271.2(K) L272.2(K) L273.2(K) L274.2(K) L275.2(K) L276.2(K) L277.2(K) L278.2(K) L279.2(K) L280.2(K) L281.2(K) L282.2(K) L283.2(K) L284.2(K) L285.2(K) L286.2(K) L287.2(K) L288.2(K) L289.2(K) L290.2(K) L291.2(K) L292.2(K) L293.2(K) L294.2(K) L295.2(K) L296.2(K) L297.2(K) L298.2(K) L299.2(K) L300.2(K) L301.2(K) L302.2(K) L303.2(K) L304.2(K) L305.2(K) L306.2(K) L307.2(K) L308.2(K) L309.2(K) L310.2(K) L311.2(K) L312.2(K) L313.2(K) L314.2(K) L315.2(K) L316.2(K) L317.2(K) L318.2(K) L319.2(K) L320.2(K) L321.2(K) L322.2(K) L323.2(K) L324.2(K) L325.2(K) L326.2(K) L327.2(K) L328.2(K) L329.2(K) L330.2(K) L331.2(K) L332.2(K) L333.2(K) L334.2(K) L335.2(K) L336.2(K) L337.2(K) L338.2(K) L339.2(K) L340.2(K) L341.2(K) L342.2(K) L343.2(K) L344.2(K) L345.2(K) L346.2(K) L347.2(K) L348.2(K) L349.2(K) L350.2(K) L351.2(K) L352.2(K) L353.2(K) L354.2(K) L355.2(K) L356.2(K) L357.2(K) L361.2(K) L362.2(K) L363.2(K) L364.2(K) L365.2(K) L366.2(K) L367.2(K) L368.2(K) L369.2(K) L370.2(K) L371.2(K) L372.2(K) L375.2(K) L376.2(K) L377.2(K) L378.2(K) L379.2(K) L380.2(K) L381.2(K) L382.2(K) L383.2(K) L384.2(K) L387.2(K) L388.2(K) L389.2(K) L390.2(K) L391.2(K) L392.2(K) L393.2(K) L394.2(K) L395.2(K) L396.2(K) L397.2(K) L398.2(K) L399.2(K) L403.2(K) L404.2(K) L405.2(K) L406.2(K) L407.2(K) L408.2(K) L409.2(K) L410.2(K) L411.2(K) L412.2(K) L413.2(K) L414.2(K) L417.2(K) L418.2(K) L419.2(K) L420.2(K) L421.2(K) L422.2(K) L423.2(K) L424.2(K) L425.2(K) L426.2(K) L427.2(K) L428.2(K) L429.2(K) L430.2(K) L431.2(K) L432.2(K) L433.2(K) L434.2(K) L435.2(K) L436.2(K) L437.2(K) L438.2(K) L439.2(K) L440.2(K) L441.2(K) L442.2(K) L443.2(K) L444.2(K) L445.2(K) L446.2(K) L447.2(K) L448.2(K) L449.2(K) L450.2(K) L451.2(K) L452.2(K) L453.2(K) L454.2(K) L455.2(K) L456.2(K) L457.2(K) L458.2(K) L459.2(K) L460.2(K) L461.2(K) L462.2(K) L463.2(K) L464.2(K) L465.2(K) L466.2(K) L467.2(K) L468.2(K) L469.2(K) L470.2(K) L471.2(K) L472.2(K) L473.2(K) L474.2(K) L475.2(K) L476.2(K) L477.2(K) L478.2(K) L479.2(K) L480.2(K) L481.2(K) L482.2(K) L483.2(K) L484.2(K) L485.2(K) L486.2(K) L487.2(K) L488.2(K) L489.2(K) L490.2(K) L491.2(K) L492.2(K) L493.2(K) L494.2(K) L495.2(K) L496.2(K) L497.2(K) L498.2(K) L499.2(K) L500.2(K) L501.2(K) L502.2(K) L503.2(K) L504.2(K) L505.2(K) L506.2(K) L507.2(K) L508.2(K) L509.2(K) L510.2(K) L511.2(K) L512.2(K) L513.2(K) L514.2(K) L515.2(K) L516.2(K) L517.2(K) L518.2(K) L519.2(K) L520.2(K) L521.2(K) L522.2(K)
A: L6.1(A) L7.1(A) L8.1(A) L9.1(A) L10.1(A) L11.1(A) L12.1(A) L13.1(A) L14.1(A) L15.1(A) L16.1(A) L17.1(A) L18.1(A) L19.1(A) L20.1(A)
A1: L175.1(A) L176.1(A) L177.1(A) L178.1(A) L179.1(A) L180.1(A) L181.1(A) L182.1(A) L183.1(A) L184.1(A) L185.1(A) L186.1(A) L187.1(A) L188.1(A) L189.1(A) L190.1(A) L191.1(A) L192.1(A)
A2: L349.1(A) L350.1(A) L351.1(A) L352.1(A) L353.1(A) L354.1(A) L355.1(A) L356.1(A) L357.1(A) L358.1(A) L359.1(A) L360.1(A) L361.1(A) L362.1(A) L363.1(A) L364.1(A) L365.1(A) L366.1(A)
B: L5.1(A) L22.1(A) L24.1(A) L26.1(A) L28.1(A) L30.1(A) L32.1(A) L34.1(A) L36.1(A) L38.1(A) L40.1(A) L42.1(A) L45.1(A) L48.1(A) L51.1(A) L54.1(A) L57.1(A) L60.1(A) L62.1(A) L64.1(A) L66.1(A) L68.1(A) L70.1(A) L72.1(A)
B1: L194.1(A) L196.1(A) L198.1(A) L200.1(A) L202.1(A) L204.1(A) L206.1(A) L208.1(A) L210.1(A) L212.1(A) L214.1(A) L216.1(A) L219.1(A) L222.1(A) L225.1(A) L228.1(A) L231.1(A) L234.1(A) L236.1(A) L238.1(A) L240.1(A) L242.1(A) L244.1(A) L246.1(A)
B2: L368.1(A) L370.1(A) L372.1(A) L374.1(A) L376.1(A) L378.1(A) L380.1(A) L382.1(A) L384.1(A) L386.1(A) L388.1(A) L390.1(A) L393.1(A) L396.1(A) L399.1(A) L402.1(A) L405.1(A) L408.1(A) L410.1(A) L412.1(A) L414.1(A) L416.1(A) L418.1(A) L420.1(A)
C: L77.1(A) L94.1(A) L96.1(A) L98.1(A) L100.1(A) L102.1(A) L104.1(A) L106.1(A) L108.1(A) L110.1(A) L112.1(A) L114.1(A) L117.1(A) L118.1(A) L121.1(A) L122.1(A) L125.1(A) L126.1(A) L129.1(A) L130.1(A) L133.1(A) L134.1(A) L137.1(A) L138.1(A) L140.1(A) L142.1(A) L144.1(A) L146.1(A) L148.1(A) L150.1(A)
C1: L266.1(A) L268.1(A) L270.1(A) L272.1(A) L274.1(A) L276.1(A) L278.1(A) L280.1(A) L282.1(A) L284.1(A) L286.1(A) L288.1(A) L291.1(A) L292.1(A) L295.1(A) L296.1(A) L299.1(A) L300.1(A) L303.1(A) L304.1(A) L307.1(A) L308.1(A) L311.1(A) L312.1(A) L314.1(A) L316.1(A) L318.1(A) L320.1(A) L322.1(A) L324.1(A)
C2: L440.1(A) L442.1(A) L444.1(A) L446.1(A) L448.1(A) L450.1(A) L452.1(A) L454.1(A) L456.1(A) L458.1(A) L460.1(A) L462.1(A) L465.1(A) L466.1(A) L469.1(A) L470.1(A) L473.1(A) L474.1(A) L477.1(A) L478.1(A) L481.1(A) L482.1(A) L485.1(A) L486.1(A) L488.1(A) L490.1(A) L492.1(A) L494.1(A) L496.1(A) L498.1(A)
D: L157.1(A) L158.1(A) L159.1(A) L160.1(A) L161.1(A) L162.1(A) L163.1(A) L164.1(A) L165.1(A) L166.1(A) L167.1(A) L168.1(A) L169.1(A) L170.1(A) L171.1(A) L172.1(A) L173.1(A) L174.1(A)
D1: L331.1(A) L332.1(A) L333.1(A) L334.1(A) L335.1(A) L336.1(A) L337.1(A) L338.1(A) L339.1(A) L340.1(A) L341.1(A) L342.1(A) L343.1(A) L344.1(A) L345.1(A) L346.1(A) L347.1(A) L348.1(A)
D2: L505.1(A) L506.1(A) L507.1(A) L508.1(A) L509.1(A) L510.1(A) L511.1(A) L512.1(A) L513.1(A) L514.1(A) L515.1(A) L516.1(A) L517.1(A) L518.1(A) L519.1(A) L520.1(A) L521.1(A) L522.1(A)
E: L76.1(A) L93.1(A) L95.1(A) L97.1(A) L99.1(A) L101.1(A) L103.1(A) L105.1(A) L107.1(A) L109.1(A) L111.1(A) L113.1(A) L115.1(A) L116.1(A) L119.1(A) L120.1(A) L123.1(A) L124.1(A) L127.1(A) L128.1(A) L131.1(A) L132.1(A) L135.1(A) L136.1(A) L139.1(A) L141.1(A) L143.1(A) L145.1(A) L147.1(A) L149.1(A)
E1: L265.1(A) L267.1(A) L269.1(A) L271.1(A) L273.1(A) L275.1(A) L277.1(A) L279.1(A) L281.1(A) L283.1(A) L285.1(A) L287.1(A) L289.1(A) L290.1(A) L293.1(A) L294.1(A) L297.1(A) L298.1(A) L301.1(A) L302.1(A) L305.1(A) L306.1(A) L309.1(A) L310.1(A) L313.1(A) L315.1(A) L317.1(A) L319.1(A) L321.1(A) L323.1(A)
E2: L439.1(A) L441.1(A) L443.1(A) L445.1(A) L447.1(A) L449.1(A) L451.1(A) L453.1(A) L455.1(A) L457.1(A) L459.1(A) L461.1(A) L463.1(A) L464.1(A) L467.1(A) L468.1(A) L471.1(A) L472.1(A) L475.1(A) L476.1(A) L479.1(A) L480.1(A) L483.1(A) L484.1(A) L487.1(A) L489.1(A) L491.1(A) L493.1(A) L495.1(A) L497.1(A)
F: L4.1(A) L21.1(A) L23.1(A) L25.1(A) L27.1(A) L29.1(A) L31.1(A) L33.1(A) L35.1(A) L37.1(A) L39.1(A) L41.1(A) L43.1(A) L44.1(A) L46.1(A) L47.1(A) L49.1(A) L50.1(A) L52.1(A) L53.1(A) L55.1(A) L56.1(A) L58.1(A) L59.1(A) L61.1(A) L63.1(A) L65.1(A) L67.1(A) L69.1(A) L71.1(A)
F1: L193.1(A) L195.1(A) L197.1(A) L199.1(A) L201.1(A) L203.1(A) L205.1(A) L207.1(A) L209.1(A) L211.1(A) L213.1(A) L215.1(A) L217.1(A) L218.1(A) L220.1(A) L221.1(A) L223.1(A) L224.1(A) L226.1(A) L227.1(A) L229.1(A) L230.1(A) L232.1(A) L233.1(A) L235.1(A) L237.1(A) L239.1(A) L241.1(A) L243.1(A) L245.1(A)
F2: L367.1(A) L369.1(A) L371.1(A) L373.1(A) L375.1(A) L377.1(A) L379.1(A) L381.1(A) L383.1(A) L385.1(A) L387.1(A) L389.1(A) L391.1(A) L392.1(A) L394.1(A) L395.1(A) L397.1(A) L398.1(A) L400.1(A) L401.1(A) L403.1(A) L404.1(A) L406.1(A) L407.1(A) L409.1(A) L411.1(A) L413.1(A) L415.1(A) L417.1(A) L419.1(A)
G: L73.1(A) L74.1(A) L75.1(A) L78.1(A) L79.1(A) L80.1(A) L81.1(A) L82.1(A) L83.1(A) L84.1(A) L85.1(A) L86.1(A) L87.1(A) L88.1(A) L89.1(A) L90.1(A) L91.1(A) L92.1(A)
G1: L247.1(A) L248.1(A) L249.1(A) L250.1(A) L251.1(A) L252.1(A) L253.1(A) L254.1(A) L255.1(A) L256.1(A) L257.1(A) L258.1(A) L259.1(A) L260.1(A) L261.1(A) L262.1(A) L263.1(A) L264.1(A)
G2: L421.1(A) L422.1(A) L423.1(A) L424.1(A) L425.1(A) L426.1(A) L427.1(A) L428.1(A) L429.1(A) L430.1(A) L431.1(A) L432.1(A) L433.1(A) L434.1(A) L435.1(A) L436.1(A) L437.1(A) L438.1(A)
H: L151.1(A) L152.1(A) L153.1(A) L154.1(A) L155.1(A) L156.1(A)
H1: L325.1(A) L326.1(A) L327.1(A) L328.1(A) L329.1(A) L330.1(A)
H2: L499.1(A) L500.1(A) L501.1(A) L502.1(A) L503.1(A) L504.1(A)
LED3.2: L358.2(K) L359.2(K) L360.2(K) L373.2(K) L374.2(K) L385.2(K) L386.2(K) L400.2(K) L401.2(K) L402.2(K) L415.2(K) L416.2(K)
NetL1_1: L1.1(A) L2.1(A) L3.1(A)
NetL169_2: L169.2(K) L170.2(K) L174.2(K)

Not connected (* = marked no-connect by the designer): L65 2(K); L71 2(K)

## Library data of the parts
L1-L522 = LED 3528 Xanh La: Dán; Don_Vi: Con; Ma_Hang: MH005547; Ten_Linh_Kien: LED3528 Màu Xanh Lá; Ghi_Chu: *; Kieu_Chan: *; Chung_Loai: Dán